# EAGLE schematic PIR-ESP-V10 (EAGLE 7.2.0)
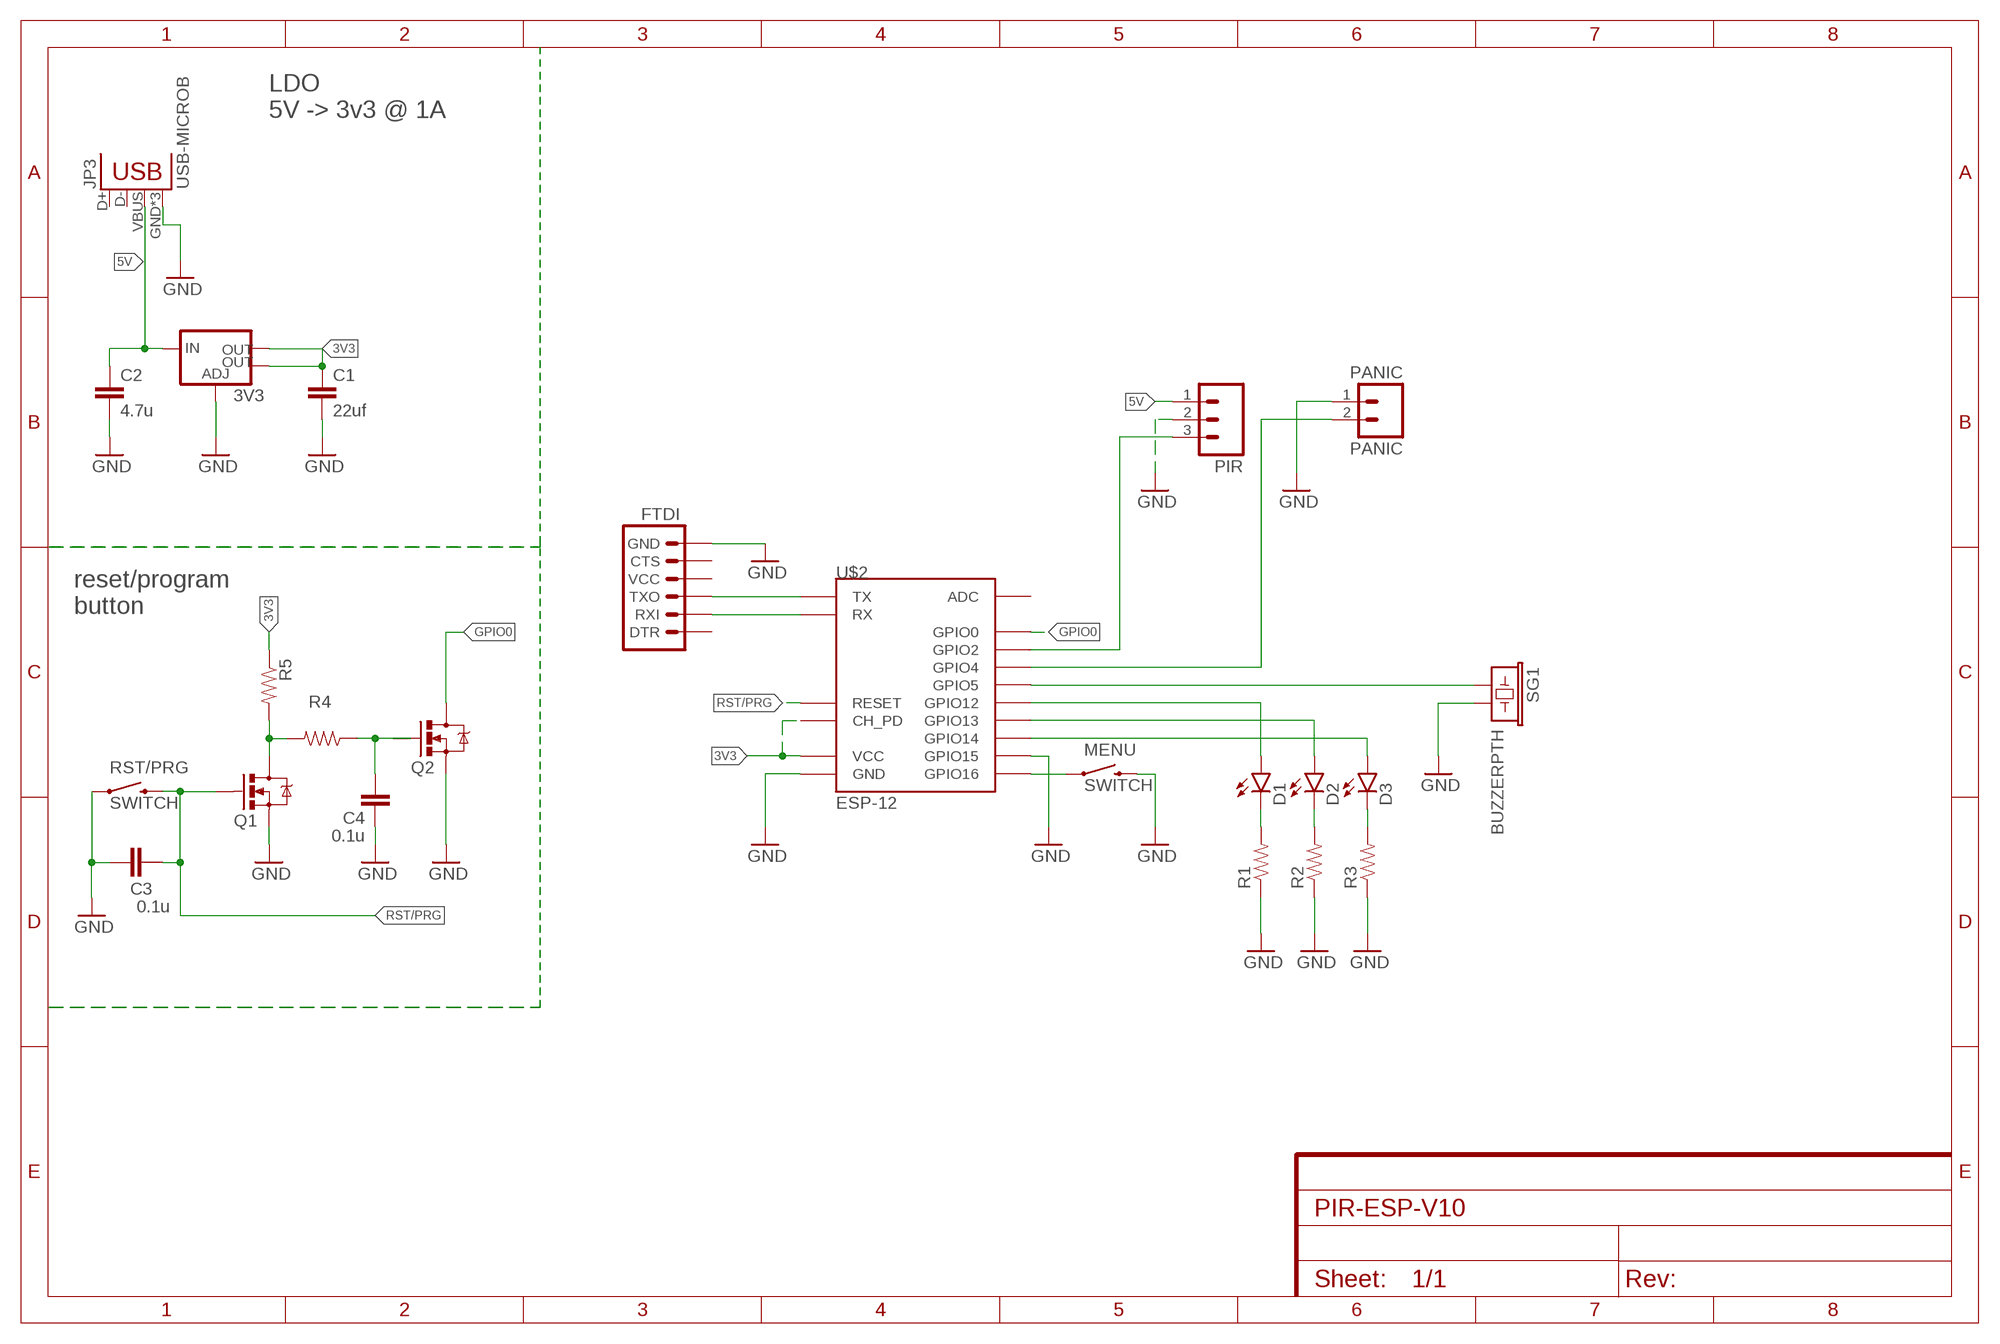
[diagram p0: schematic, sheet 1]

## Parts
3V3  V_REG_LM1117SOT223  [SOT223]
C1  22uf  CAP1206  [1206]
C2  4.7u  CAP1206  [1206]
C3  0.1u  CAP1206  [1206]
C4  0.1u  CAP1206  [1206]
D1  LED5MM  [LED5MM]
D2  LED5MM  [LED5MM]
D3  LED5MM  [LED5MM]
FTDI  ARDUINO_SERIAL_PROGRAMLOCK  [1X06_LOCK]
JP3  USB-MICROB  [USB-MICROB]
MENU  SWITCH  SWITCH-MOMENTARY-2SIDE_EZ  [TACTILE-PTH-SIDEEZ]
PANIC  PANIC  M02PTH3  [1X02_LONGPADS]
PIR  M03LONGPADS  [1X03_LONGPADS]
Q1  200mA/50V  MOSFET-NCHANNELBSS138  [SOT23-3]
Q2  200mA/50V  MOSFET-NCHANNELBSS138  [SOT23-3]
R1  RESISTOR1206  [1206]
R2  RESISTOR1206  [1206]
R3  RESISTOR1206  [1206]
R4  RESISTOR1206  [1206]
R5  RESISTOR1206  [1206]
RST/PRG  SWITCH  SWITCH-MOMENTARY-2SIDE_EZ  [TACTILE-PTH-SIDEEZ]
SG1  BUZZERPTH  [BUZZER-12MM]
U$2  ESP-12  [ESP-12]

## Nets
3V3: 3V3.2(OUT) 3V3.4(OUT) C1.1 R5.1 U$2.CH_PD U$2.VCC
5V: 3V3.3(IN) C2.1 JP3.VBUS PIR.1
GND: 3V3.1(ADJ) C1.2 C2.2 C3.1 C4.1 FTDI.6(GND) JP3.GND JP3.MT1(GND) JP3.MT2(GND) MENU.2 PANIC.1 PIR.2 Q1.2(S) Q2.2(S) R1.1 R2.1 R3.1 RST/PRG.1 SG1.- U$2.GND U$2.GPIO15
GPIO0: Q2.3(D) U$2.GPIO0
N$1: D1.A U$2.GPIO12
N$2: SG1.+ U$2.GPIO5
N$3: FTDI.3(TXO) U$2.TX
N$4: MENU.1 U$2.GPIO16
N$5: FTDI.2(RXI) U$2.RX
N$6: D1.K(C) R1.2
N$7: D2.K(C) R2.2
N$8: D3.K(C) R3.2
N$9: PANIC.2 U$2.GPIO4
N$10: D2.A U$2.GPIO13
N$11: D3.A U$2.GPIO14
N$12: PIR.3 U$2.GPIO2
N$14: C4.2 Q2.1(G) R4.1
N$16: Q1.3(D) R4.2 R5.2
RST/PRG: C3.2 Q1.1(G) RST/PRG.2 U$2.RESET
Unconnected: FTDI.1(DTR) FTDI.4(VCC) FTDI.5(CTS) JP3.D+ JP3.D- U$2.ADC

## Notes on the sheet
- LDO
  5V -> 3v3 @ 1A
- reset/program
  button

## Library data of the parts
3V3 = SparkFun-PowerIC:V_REG_LM1117: Voltage Regulator LM1117 Standard adjustable voltage regulator but in SMD form. Spark Fun Electronics SKU : COM-00595; PROD_ID: VREG-08170
C1-C4 = SparkFun-Passives:CAP: Capacitor Standard 0603 ceramic capacitor, and 0.1" leaded capacitor.
D1-D3 = SparkFun-LED:LED: LEDs Standard schematic elements and footprints for 5mm, 3mm, 1206, and 0603 sized LEDs. 5mm - Spark Fun Electronics SKU : COM-00529 (and others)
FTDI = SparkFun-Connectors:ARDUINO_SERIAL_PROGRAM: FTDI connector footprints
JP3 = SparkFun-Connectors:USB: USB Connectors USB-B-PTH is fully proven SKU : PRT-00139/CONN-08278 USB-miniB is fully proven SKU : PRT-00587 USB-A-PCB is untested. USB-A-H is throughly reviewed, but untested. Spark Fun Electronics SKU : PRT-00437 USB-B-SMT is throughly reviewed, but untested. Needs silkscreen touching up. USB-A-S has not been used/tested USB-MB-H has not been used/tested USB-MICROB has been used. CONN-09505; PROD_ID: CONN-09505
MENU RST/PRG = SparkFun-Electromechanical:SWITCH-MOMENTARY-2: Various NO switches- pushbuttons, reed, etc
PANIC = SparkFun-Connectors:M02: Standard 2-pin 0.1" header. Use with - straight break away headers ( PRT-00116) - right angle break away headers (PRT-00553) - swiss pins (PRT-00743) - machine pins (PRT-00117) - female headers (PRT-00115) Molex polarized connector foot print use with: PRT-08233 with associated crimp pins and housings. 2.54_SCREWTERM for use with PRT-10571. 3.5mm Screw Terminal footprints for PRT-08084 5mm Screw Terminal footprints for use with PRT-08432
PIR = SparkFun-Connectors:M03: Header 3 Standard 3-pin 0.1" header. Use with straight break away headers (SKU : PRT-00116), right angle break away headers (PRT-00553), swiss pins (PRT-00743), machine pins (PRT-00117), and female headers (PRT-00115). Molex polarized connector foot print use with SKU : PRT-08232 with associated crimp pins and housings.
Q1 Q2 = SparkFun-DiscreteSemi:MOSFET-NCHANNEL: Common NMOSFET Parts MFG P/N Store ID Prod ID FDD8780 TRANS-09984 SI7820DN TRANS-11055 FDS6630A IC-08089 2N7002PW TRANS-11151 FQP30N06L COM-10213 TRANS-10060 BSS123LT1G TRANS-08345 BSS138 TRANS-00830 BS170 2N7000; PROD_ID: TRANS-00830
R1-R5 = SparkFun-Passives:RESISTOR: Resistor Basic schematic elements and footprints for 0603, 1206, and PTH resistors.
SG1 = SparkFun-Electromechanical:BUZZER: Buzzer 12mm Spark Fun Electronics SKU : Comp-Buzzer
U$2 = esp8266modules:ESP-12: ESP8266 Wifi Module ESP-12; DIMENSIONS: 24.0 x 16.0 mm; PINS: 16; PITCH: 0.078" / 2 mm